# EAGLE design main (EAGLE 9.6.2)
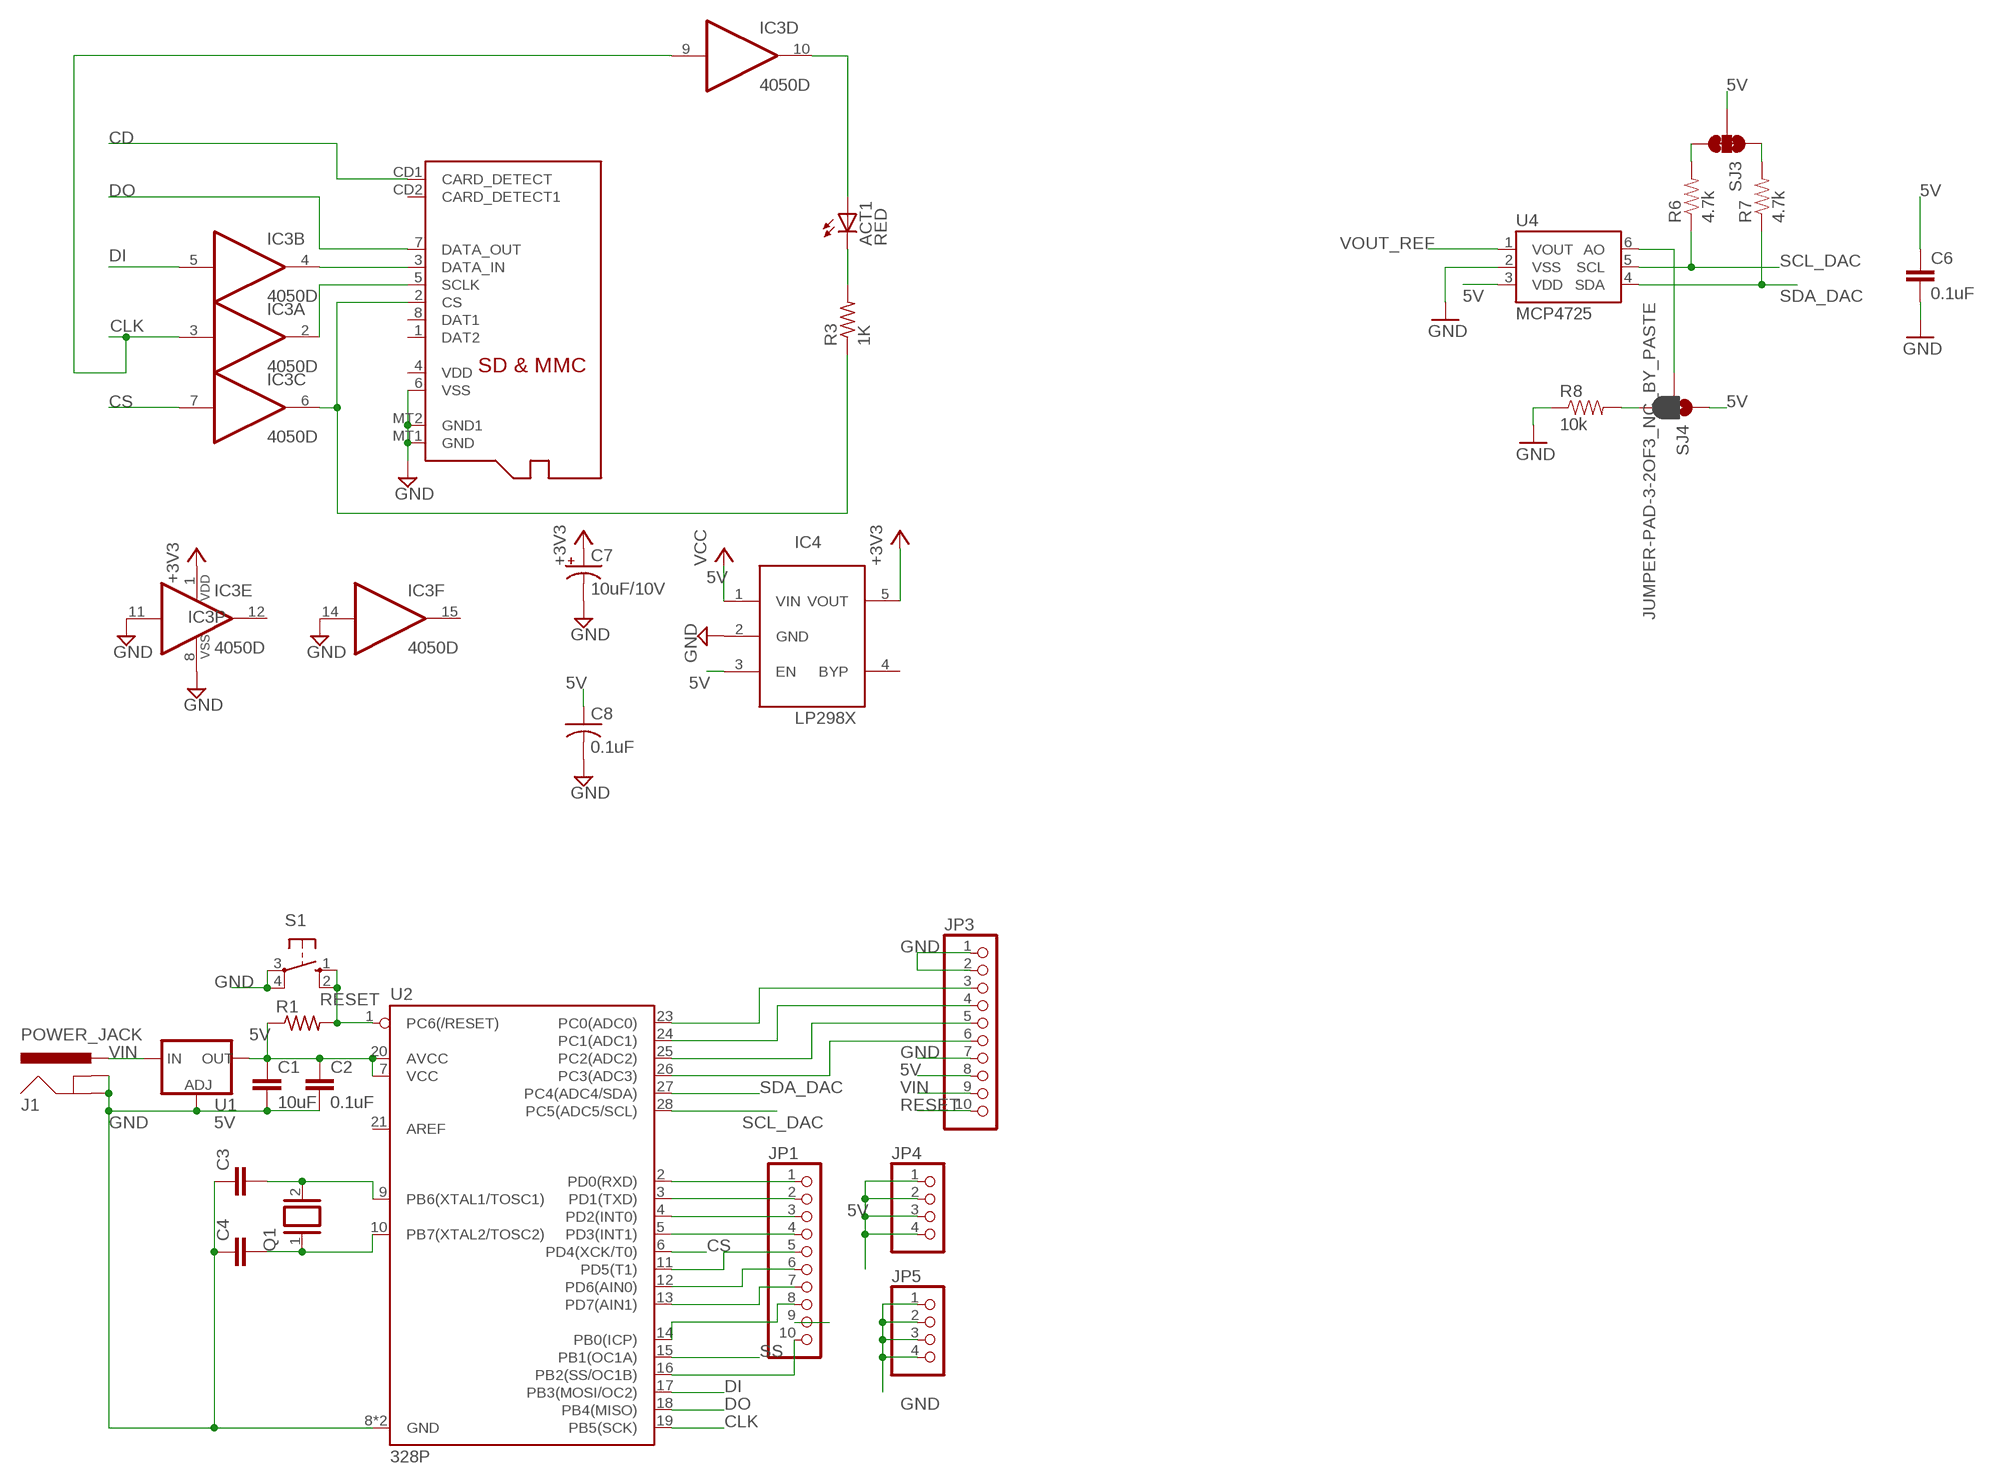
[diagram p0: schematic, sheet 1]

## Parts
ACT1  RED  LEDCHIP-LED0805  [CHIP-LED0805]
C1  10uF  C-EU025-024X044  [C025-024X044]
C2  0.1uF  C-EU025-024X044  [C025-024X044]
C3  C-EU025-024X044  [C025-024X044]
C4  C-EU025-024X044  [C025-024X044]
C6  0.1uF  CAP0603-CAP  [0603-CAP]
C7  10uF/10V  CPOL-USA/3216-18R  [A/3216-18R]
C8  0.1uF  C-USC0805K  [C0805K]
IC3  4050D  [SO16]
IC4  LP298XS  [SOT23-5L]
J1  POWER_JACK  [POWER_JACK_PTH]
JP1  PINHD-1X10  [1X10]
JP3  PINHD-1X10  [1X10]
JP4  PINHD-1X4  [1X04]
JP5  PINHD-1X4  [1X04]
Q1  XTAL/S  [QS]
R1  R-US_0204/7  [0204/7]
R3  1K  R-US_R0805  [R0805]
R6  4.7k  RESISTOR0603-RES  [0603-RES]
R7  4.7k  RESISTOR0603-RES  [0603-RES]
R8  10k  RESISTOR0603-RES  [0603-RES]
S1  10-XX  [B3F-10XX]
SJ3  JUMPER-PAD-3-NC_BY_TRACE  [PAD-JUMPER-3-3OF3_NC_BY_TRACE_YES_SILK_FULL_BOX]
SJ4  JUMPER-PAD-3-2OF3_NC_BY_PASTE  [PAD-JUMPER-3-2OF3_NC_BY_PASTE_YES_SILK_FULL_BOX]
U1  5V  V_REG_LM1117SOT223  [SOT223]
U2  328P  ATMEGA328P_PDIP  [DIP28]
U4  MCP4725  MCP4725SOT-23  [SOT23-6]
X2  MICROSD  [MICROSD]

## Nets
5V: C1.1 C2.1 C6.1 C8.1 IC4.1(VIN) IC4.3(EN) JP3.8 JP4.1 JP4.2 JP4.3 JP4.4 R1.1 SJ3.2 SJ4.1 U1.2(OUT) U1.4(OUT) U2.7(VCC) U2.20(AVCC) U4.3(VDD) ; supply symbol labelled VCC
+3V3: C7.+ IC3.1(P:VDD) IC4.5(VOUT)
CD: X2.CD1(CARD_DETECT)
CLK: IC3.3(A:I) IC3.9(D:I) U2.19(PB5(SCK))
CS: IC3.7(C:I) U2.6(PD4(XCK/T0))
DI: IC3.5(B:I) U2.17(PB3(MOSI/OC2))
DO: U2.18(PB4(MISO)) X2.7(DATA_OUT)
GND: C1.2 C2.2 C3.1 C4.1 C6.2 C7.- C8.2 IC3.8(P:VSS) IC3.11(E:I) IC3.14(F:I) IC4.2(GND) J1.GND J1.GNDBREAK JP3.1 JP3.2 JP3.7 JP5.1 JP5.2 JP5.3 JP5.4 R8.1 S1.3(P) S1.4(P1) U1.1(ADJ) U2.8(GND) U2.22(GND) U4.2(VSS) X2.6(VSS) X2.MT1(GND) X2.MT2(GND1)
N$1: JP1.1 U2.2(PD0(RXD))
N$2: JP3.5 U2.25(PC2(ADC2))
N$3: C3.2 Q1.2 U2.9(PB6(XTAL1/TOSC1))
N$4: C4.2 Q1.1 U2.10(PB7(XTAL2/TOSC2))
N$5: JP1.2 U2.3(PD1(TXD))
N$6: JP1.3 U2.4(PD2(INT0))
N$7: JP3.6 U2.26(PC3(ADC3))
N$8: JP1.4 U2.5(PD3(INT1))
N$9: JP1.5 U2.11(PD5(T1))
N$10: R7.2 SJ3.1
N$11: R6.2 SJ3.3
N$12: SJ4.2 U4.6(AO)
N$13: R8.2 SJ4.3
N$14: JP1.6 U2.12(PD6(AIN0))
N$15: JP1.7 U2.13(PD7(AIN1))
N$16: JP1.8 U2.14(PB0(ICP))
N$18: JP1.10 U2.16(PB2(SS/OC1B))
N$20: U2.23(PC0(ADC0))
N$22: JP3.3
N$23: JP3.4 U2.24(PC1(ADC1))
N$35: ACT1.A IC3.10(D:O)
N$36: IC3.2(A:O) X2.5(SCLK)
N$37: IC3.6(C:O) R3.1 X2.2(CS)
N$38: ACT1.C R3.2
N$39: IC3.4(B:O) X2.3(DATA_IN)
RESET: JP3.10 R1.2 S1.1(S) S1.2(S1) U2.1(PC6(/RESET))
SCL_DAC: R6.1 U2.28(PC5(ADC5/SCL)) U4.5(SCL)
SDA_DAC: R7.1 U2.27(PC4(ADC4/SDA)) U4.4(SDA)
SS: JP1.9 U2.15(PB1(OC1A))
VIN: J1.PWR JP3.9 U1.3(IN)
VOUT_REF: U4.1(VOUT)
Unconnected: IC3.12(E:O) IC3.15(F:O) IC4.4(BYP) U2.21(AREF) X2.1(DAT2) X2.4(VDD) X2.8(DAT1) X2.CD2(CARD_DETECT1)

## Library data of the parts
ACT1 = adafruit:LED: LED OSRAM: - CHIPLED LG R971, LG N971, LY N971, LG Q971, LY Q971, LO R971, LY R971 LH N974, LH R974 LS Q976, LO Q976, LY Q976 LO Q996 - Hyper CHIPLED LW Q18S LB Q993, LB Q99A, LB R99A - SideLED LS A670, LO A670, LY A670, LG A670, LP A670 LB A673, LV A673, LT A673, LW A673 LH A674 LY A675 LS A676, LA A676, LO A676, LY A676, LW A676 LS A679, LY A679, LG A679 - Hyper Micro SIDELED® LS Y876, LA Y876, LO Y876, LY Y876 LT Y87S - SmartLED LW L88C, LW L88S LB L89C, LB L89S, LG L890 LS L89K, LO L89K, LY L89K LS L896, LA L896, LO L896, LY L896 - TOPLED LS T670, LO T670, LY T670, LG T670, LP T670 LSG T670, LSP T670, LSY T670, LOP T670, LYG T670 LG T671, LOG T671, LSG T671 LB T673, LV T673, LT T673, LW T673 LH T674 LS T676, LA T676, LO T676, LY T676, LB T676, LH T676, LSB T676, LW T676 LB T67C, LV T67C, LT T67C, LS T67K, LO T67K, LY T67K, LW E67C LS E67B, LA E67B, LO E67B, LY E67B, LB E67C, LV E67C, LT E67C LW T67C LS T679, LY T679, LG T679 LS T770, LO T770, LY T770, LG T770, LP T770 LB T773, LV T773, LT T773, LW T773 LH T774 LS E675, LA E675, LY E675, LS T675 LS T776, LA T776, LO T776, LY T776, LB T776 LHGB T686 LT T68C, LB T68C - Hyper Mini TOPLED® LB M676 - Mini TOPLED Santana® LG M470 LS M47K, LO M47K, LY M47K Source: http://www.osram.convergy.de/
C1-C4 = rcl:C-EU: CAPACITOR, European symbol; SPICEPREFIX: C
C6 = SparkFun:CAP: Capacitor Standard 0603 ceramic capacitor, and 0.1" leaded capacitor.
C7 = adafruit:CPOL-US: POLARIZED CAPACITOR, American symbol
C8 = adafruit:C-US: CAPACITOR, American symbol
IC3 = 40xx:4050: Hex non-inverting BUFFER
IC4 = adafruit:LP298X
J1 = SparkFun-Connectors:POWER_JACK: Power Jack Connector This is the standard 5.5mm barrel jack for power. The PTH is the most common, proven, reliable, footprint. The Slot footprint only works if the mill layer is transmitted to the PCB fab house so be warned. Here are the connectors we sell at SparkFun: DC Barrel Power Jack/Connector <https://www.sparkfun.com/products/119> (PRT-00119) DC Barrel Power Jack/Connector (SMD) <https://www.sparkfun.com/products/12748> (PRT-12748) DC Barrel Jack Adapter - Breadboard Compatible <https://www.sparkfun.com/products/10811> (PRT-10811) It is used on this SparkFun product (and many, many others): SparkFun RedBoard - Programmed with Arduino <https://www.sparkfun.com/products/12757> (DEV-12757) Also, if you need a mating power supply or connector, please check these out: Wall Adapter Power Supply - 9VDC 650mA <https://www.sparkfun.com/products/298> (TOL-00298) DC Barrel Jack Adapter - Male <https://www.sparkfun.com/products/10287> (PRT-10287); PROD_ID: CONN-08197
JP1 JP3 = pinhead:PINHD-1X10: PIN HEADER
JP4 JP5 = pinhead:PINHD-1X4: PIN HEADER
Q1 = special:XTAL/S: CRYSTAL
R1 = rcl:R-US_: RESISTOR, American symbol; SPICEPREFIX: R
R3 = adafruit:R-US_: RESISTOR, American symbol
R6-R8 = SparkFun:RESISTOR: Resistor Basic schematic elements and footprints for 0603, 1206, and PTH resistors.
S1 = switch-omron:10-XX: OMRON SWITCH; MPN: B3F-1000; OC_FARNELL: 176432; OC_NEWARK: 36M3542
SJ3 = SparkFun-Passives:JUMPER-PAD-3-NC_BY_TRACE
SJ4 = SparkFun-Passives:JUMPER-PAD-3-2OF3_NC_BY_PASTE
U1 = SparkFun-IC-Power:V_REG_LM1117: Voltage Regulator LM1117 Standard adjustable voltage regulator but in SMD form. Spark Fun Electronics SKU : COM-00595; PROD_ID: VREG-08170
U2 = SparkFun-IC-Microcontroller:ATMEGA328P_PDIP: Atmel 328P Through hole ATMEGA328P uC used in the Arduino 32kb flash, 1k EEPROM, 2k SRAM Datasheet <http://www.sparkfun.com/datasheets/Components/SMD/ATMega328.pdf> SparkFun Products Storefront component: AVR 28 Pin 20MHz 32K 6A/D - ATMega328P <https://www.sparkfun.com/products/9061> (COM-09061) SparkFun Simon Says - Through-Hole Soldering Kit <https://www.sparkfun.com/products/10547> (KIT-10547) SparkFun Learn to Solder - Simon Says <https://www.sparkfun.com/products/13708> (KIT-13708) SparkFun BigTime Watch Kit <https://www.sparkfun.com/products/11734> (KIT-11734) SparkFun ClockIt <https://www.sparkfun.com/products/10930> (KIT-10930) SparkFun Serial Enabled LCD Kit <https://www.sparkfun.com/products/10097> (LCD-10097) SparkFun Simon Tilts - Through Hole Soldering Kit <https://www.sparkfun.com/products/12634> (KIT-12634) SparkFun Frequency Counter Kit <https://www.sparkfun.com/products/10140> (KIT-10140) FabFM Radio Kit <https://www.sparkfun.com/products/11043> (KIT-11043) SparkFun Binary Blaster Kit <https://www.sparkfun.com/products/12037> (KIT-12037) SparkFun Metro-Gnome <https://www.sparkfun.com/products/9236> (KIT-09236) ATmega328 with Arduino Optiboot (Uno) <https://www.sparkfun.com/products/10524> (DEV-10524); PROD_ID: IC-09136
U4 = SparkFun-AnalogIC:MCP4725: Microchip 12-bit I2C DAC, SOT23-6; PROD_ID: IC-08886
X2 = adafruit:MICROSD: Micro-SD / Transflash card holder with SPI pinout For the 3M # 2908-05WB-MG and/or 4UCON #19656 push-push type

## Board
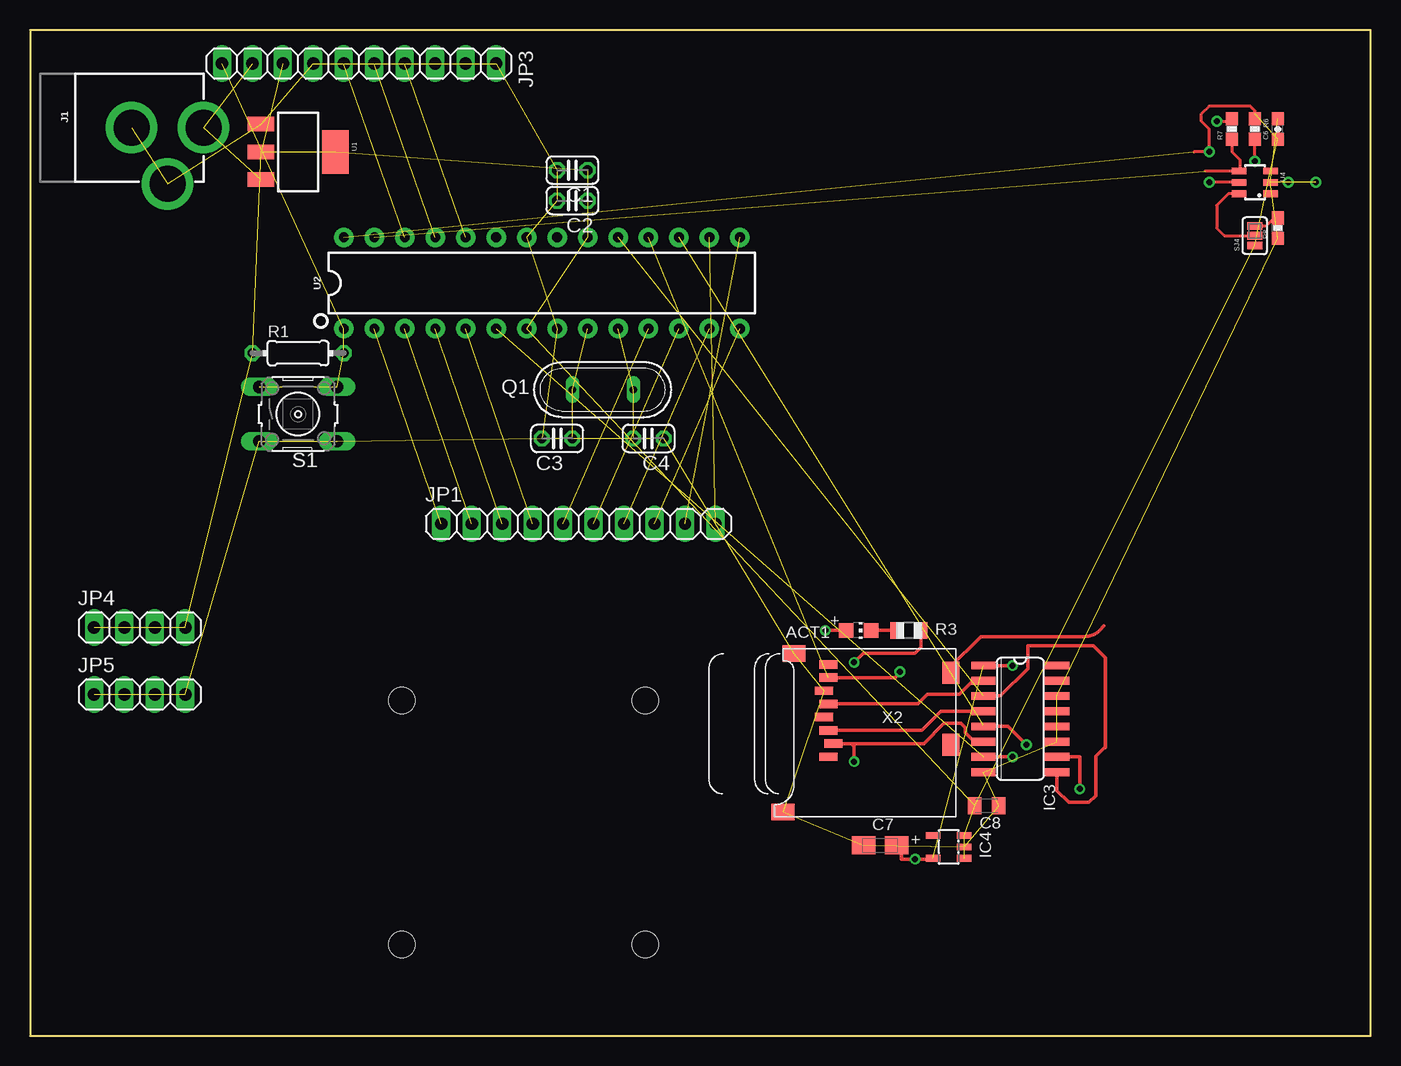
[diagram p1: board, top side]
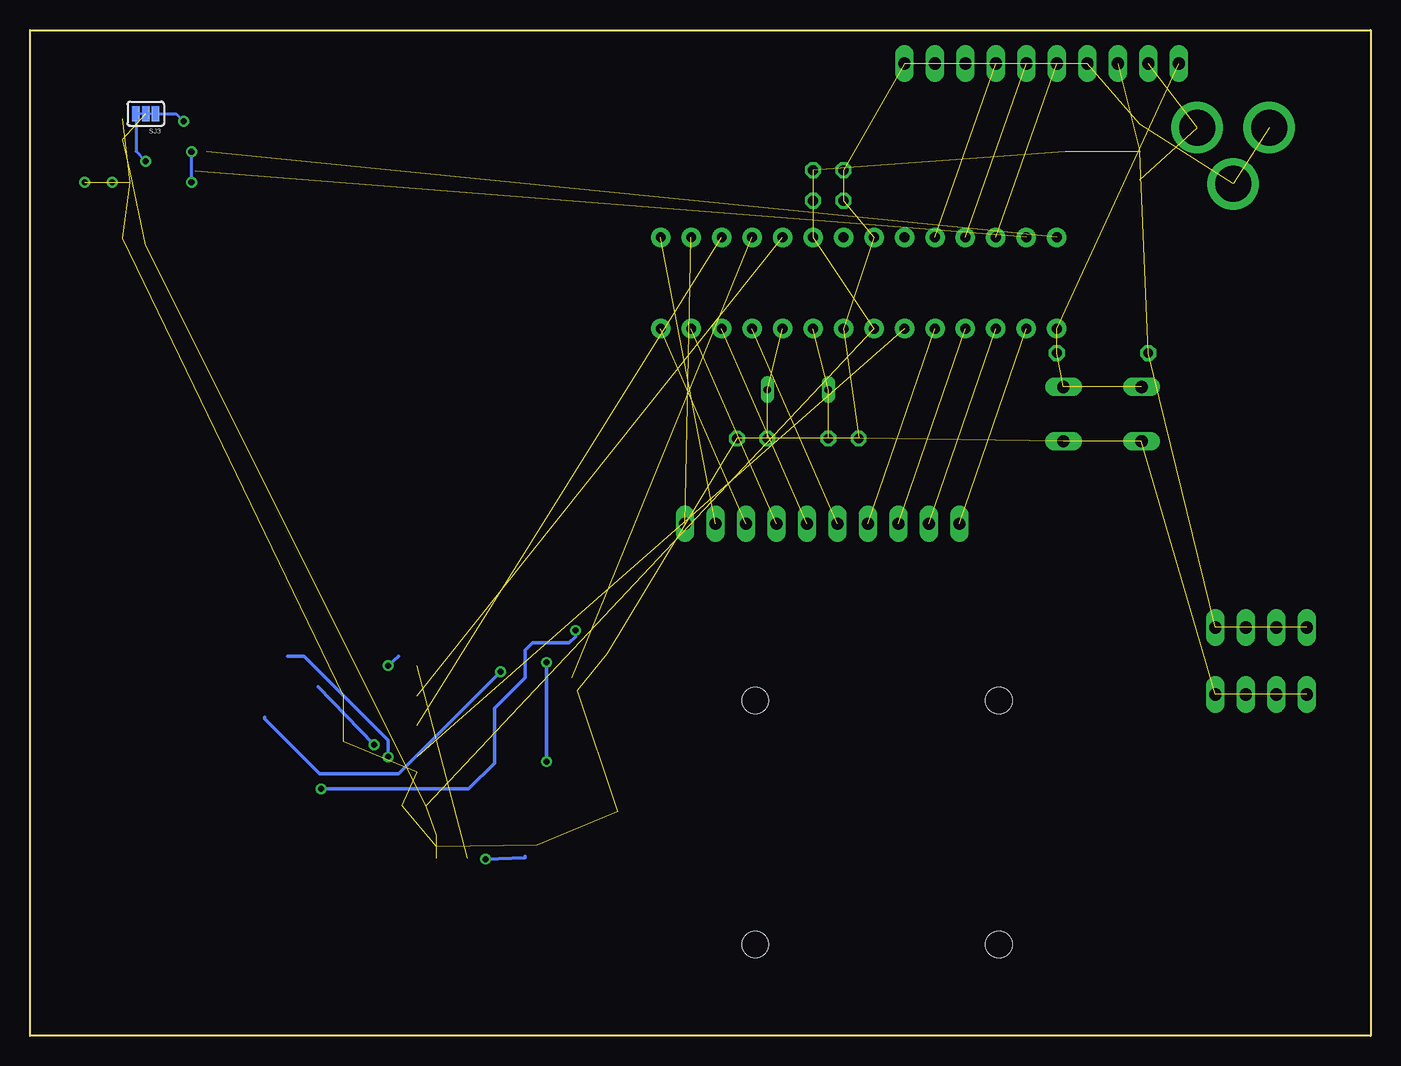
[diagram p2: board, bottom side, seen from below]

Size 111.76 x 83.82 mm. Coordinates in mm from the lower left corner, seen from the top.
Outline: 0,83.82 0,0 111.76,0 111.76,83.82 0,83.82
Copper layers (1*16): Top 0.035mm / dielectric 1.5mm / Bottom 0.035mm
Design rules "default": minimum track width 6mil, minimum drill 0.35mm, track to track 6mil, track to pad 6mil, pad to pad 6mil, via to via 6mil, smd to smd 6mil, copper to edge 40mil, drill to drill 6mil, minimum pad ring 10mil, minimum via ring 8mil, stop-mask expansion 4mil, vias tented up to drill 0mil, thermal gap 10mil
Holes 2.2 mm at 30.99,27.94 30.99,7.62 51.31,27.94 51.31,7.62

### Footprints (pad centres in the part's own frame; a part is rotated, then mirrored left to right if it is on the bottom)
CHIP-LED0805 = smd 1.2 x 1.2: A 0,-1.05; C 0,1.05
C025-024X044 = drill 0.813 octagon: 1 -1.27,0; 2 1.27,0
0603-CAP = smd 1.1 x 1: 1 -0.85,0; 2 0.85,0
A/3216-18R = smd 1.95 x 1.5: + 1.375,0; - -1.375,0
C0805K = smd 1.1 x 1.4: 1 -1,0; 2 1,0
SO16 = smd 0.66 x 2.032: 1 -4.445,-3.073; 2 -3.175,-3.073; 3 -1.905,-3.073; 4 -0.635,-3.073; 5 0.635,-3.073; 6 1.905,-3.073; 7 3.175,-3.073; 8 4.445,-3.073; 9 4.445,3.073; 10 3.175,3.073; 11 1.905,3.073; 12 0.635,3.073; 13 -0.635,3.073; 14 -1.905,3.073; 15 -3.175,3.073; 16 -4.445,3.073
SOT23-5L = smd 0.55 x 1.2: 1 -0.95,-1.3; 2 0,-1.3; 3 0.95,-1.3; 4 0.95,1.3; 5 -0.95,1.3
POWER_JACK_PTH = drill 2.997 pad 4.318: GND 0,7.7; GNDBREAK 4.7,10.7; PWR 0,13.7
1X10 = drill 1.016 long: 1 -11.43,0; 2 -8.89,0; 3 -6.35,0; 4 -3.81,0; 5 -1.27,0; 6 1.27,0; 7 3.81,0; 8 6.35,0; 9 8.89,0; 10 11.43,0
1X04 = drill 1.016 long: 1 -3.81,0; 2 -1.27,0; 3 1.27,0; 4 3.81,0
QS = drill 0.61 long: 1 -2.54,0; 2 2.54,0
0204/7 = drill 0.813 octagon: 1 -3.81,0; 2 3.81,0
R0805 = smd 1.1 x 1.4: 1 -1,0; 2 1,0
0603-RES = smd 1.1 x 1: 1 -0.85,0; 2 0.85,0
B3F-10XX = drill 1.016 long: 1 -3.251,2.261; 2 3.251,2.261; 3 -3.251,-2.261; 4 3.251,-2.261
PAD-JUMPER-3-3OF3_NC_BY_TRACE_YES_SILK_FULL_BOX = smd 0.635 x 1.27: 1 -0.813,0; 2 0,0; 3 0.813,0
PAD-JUMPER-3-2OF3_NC_BY_PASTE_YES_SILK_FULL_BOX = smd 0.635 x 1.27: 1 -0.813,0; 2 0,0; 3 0.813,0
SOT223 = smd 1.219 x 2.235: 1 -2.311,-3.099; 2 0,-3.099; 3 2.311,-3.099 | smd 3.6 x 2.2: 4 0,3.099
DIP28 = drill 0.813 pad 1.626: 1 -16.51,-3.81; 2 -13.97,-3.81; 3 -11.43,-3.81; 4 -8.89,-3.81; 5 -6.35,-3.81; 6 -3.81,-3.81; 7 -1.27,-3.81; 8 1.27,-3.81; 9 3.81,-3.81; 10 6.35,-3.81; 11 8.89,-3.81; 12 11.43,-3.81; 13 13.97,-3.81; 14 16.51,-3.81; 15 16.51,3.81; 16 13.97,3.81; 17 11.43,3.81; 18 8.89,3.81; 19 6.35,3.81; 20 3.81,3.81; 21 1.27,3.81; 22 -1.27,3.81; 23 -3.81,3.81; 24 -6.35,3.81; 25 -8.89,3.81; 26 -11.43,3.81; 27 -13.97,3.81; 28 -16.51,3.81
SOT23-6 = smd 0.55 x 1.2: 1 0.95,1.3; 2 0,1.3; 3 -0.95,1.3; 4 -0.95,-1.3; 5 0,-1.3; 6 0.95,-1.3
MICROSD = smd 0.7 x 1.5: 1 9,-10.64; 2 7.9,-10.24; 3 6.8,-10.64; 4 5.7,-11.04; 5 4.6,-10.64; 6 3.5,-11.04; 7 2.4,-10.64; 8 1.3,-10.64 | smd 1.8 x 1.4: CD1 2,-0.44; CD2 8,-0.44 | smd 1.4 x 1.9: MT1 0.4,-13.54; MT2 13.6,-14.44

### Placement (x,y rotation side)
ACT1  69.09,33.78 270 top
C1  45.21,72.14 180 top
C2  45.21,69.6 180 top
C3  43.94,49.78 0 top
C4  51.56,49.78 180 top
C6  104.01,75.56 90 top
C7  70.87,15.88 0 top
C8  79.76,19.18 0 top
IC3  82.55,26.42 270 top
IC4  76.58,15.75 90 top
J1  0.76,75.69 270 top
JP1  45.72,42.67 0 top
JP3  27.43,81.03 180 top
JP4  9.14,34.04 0 top
JP5  9.14,28.45 0 top
Q1  47.75,53.85 180 top
R1  22.35,56.9 0 top
R3  73.28,33.78 180 top
R6  102.11,75.56 270 top
R7  100.2,75.56 90 top
R8  104.01,67.31 90 top
S1  22.35,51.82 0 top
SJ3  102.11,76.84 180 bottom
SJ4  102.11,66.67 90 top
U1  22.35,73.66 270 top
U2  42.67,62.74 0 top
U4  102.11,71.12 270 top
X2  77.22,32.26 270 top

### Tracks (layer width: path | path; a pad name or v marks a point on that pad's centre or on a via)
5V  (18 unrouted)
+3V3  (via drill 0.5)  (1 unrouted)
  Top 0.305: IC3.1 v81.92,30.86 | v73.79,14.73 73.82,14.73 | IC4.5 75.22,14.73 v73.79,14.73 | C7.+ 72.64,15.88 72.64,14.73 v73.79,14.73
  Bottom 0.305: v81.92,30.86 81.03,31.62 | v73.79,14.73 70.48,14.86 70.48,14.99
CD
  Top 0.305: X2.CD1 76.71,29.97 76.71,30.7 79.28,33.27 87.91,33.27 arc45 89.17,33.8 89.53,34.16
CLK  (1 unrouted)
  Top 0.305: IC3.3 80.9,28.32 83.19,30.61 83.19,32.51 88.65,32.51 89.66,31.5 89.66,24 89.6,24 89.58,24.02 88.85,23.29 88.85,20.02 88.28,19.45 86.58,19.45 85.62,20.41 IC3.9
CS  (via drill 0.5)  (1 unrouted)
  Top 0.305: IC3.7 v81.92,23.24
  Bottom 0.305: v81.92,23.24 81.92,24.64 88.9,31.62 90.3,31.62
DI  (via drill 0.5)  (1 unrouted)
  Top 0.305: v83.06,24.26 81.53,25.78 79.56,25.78 79.48,25.86 | 79.48,25.86 79.47,25.87 | IC3.5 79.48,25.86
  Bottom 0.305: v83.06,24.26 87.76,29.08
DO  (via drill 0.5)  (1 unrouted)
  Top 0.305: X2.7 72.15,29.86 v72.52,30.35
  Bottom 0.305: v72.52,30.35 81.03,21.84 87.63,21.84 92.2,26.42 92.2,26.54
GND  (via drill 0.51)  (31 unrouted)
  other vias: 107.19,71.12 104.9,71.12
N$1  (1 unrouted)
N$2  (1 unrouted)
N$3  (2 unrouted)
N$4  (2 unrouted)
N$5  (1 unrouted)
N$6  (1 unrouted)
N$7  (1 unrouted)
N$8  (1 unrouted)
N$9  (1 unrouted)
N$10  (via drill 0.51)
  Top 0.254: v98.93,76.2 99.99,76.2 R7.2
  Bottom 0.254: v98.93,76.2 99.57,76.84 SJ3.1
N$11  (via drill 0.51)
  Top 0.254: v102.11,72.9 R6.2
  Bottom 0.254: v102.11,72.9 102.92,73.71 SJ3.3
N$12
  Top 0.254: U4.6 99.89,70.17 98.93,69.22 98.93,67.31 99.57,66.67 SJ4.2
N$13
  Top 0.254: SJ4.3 103.05,67.49 103.72,68.16 R8.2
N$14  (1 unrouted)
N$15  (1 unrouted)
N$16  (1 unrouted)
N$18  (1 unrouted)
N$23  (1 unrouted)
N$35  (via drill 0.5)
  Top 0.305: v66.29,33.78 ACT1.A | IC3.10 87.5,23.24 v87.5,20.57
  Bottom 0.305: v87.5,20.57 75.18,20.57 73.03,22.73 73.03,27.3 70.48,29.84 70.48,32.13 69.85,32.77 66.8,32.77 66.29,33.27 v66.29,33.78
N$36
  Top 0.305: X2.5 74.01,27.66 74.8,28.45 77.47,28.45 78.61,29.59 IC3.2 79.63,29.59
N$37  (via drill 0.5)
  Top 0.305: X2.2 68.58,24.36 | 68.58,24.36 74.52,24.36 76.2,26.04 77.6,26.04 77.98,25.65 77.98,25.27 78.74,24.51 IC3.6 79.63,24.51 79.76,24.64 | R3.1 74.28,32.37 73.79,31.88 69.47,31.88 v68.71,31.12 | 68.58,24.36 68.58,24.26 68.71,24.13 v68.71,22.86
  Bottom 0.305: v68.71,22.86 v68.71,31.12
N$38
  Top 0.305: R3.2 72.28,33.89 72.26,33.91 72.14,33.78 ACT1.C
N$39
  Top 0.305: X2.3 74.35,25.46 75.95,27.05 IC3.4
RESET  (4 unrouted)
SCL_DAC  (via drill 0.51)  (1 unrouted)
  Top 0.254: U4.5 v98.3,71.12 | 97.03,73.66 v98.3,73.66 98.3,75.56 97.66,76.2 97.66,76.84 98.3,77.47 101.73,77.47 102.11,77.09 R6.1
  Bottom 0.254: v98.3,71.12 v98.3,73.66
SDA_DAC  (1 unrouted)
  Top 0.254: 97.98,72.07 U4.4 100.84,72.1 100.84,73.03 100.2,73.66 R7.1
SS  (1 unrouted)
VIN  (2 unrouted)